# EAGLE schematic pos_sys (EAGLE 6.3)
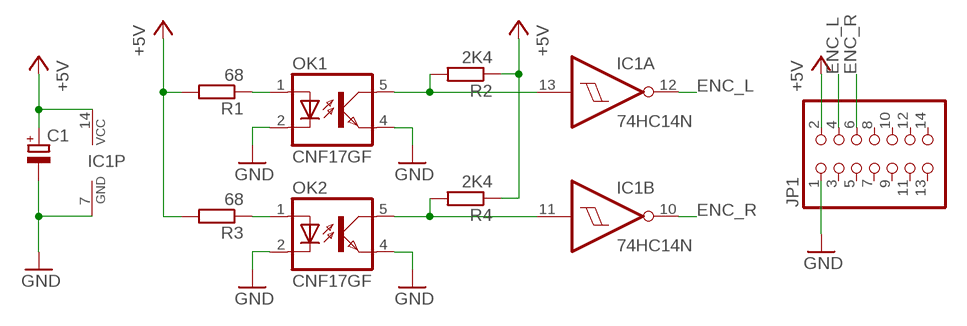
[diagram p0: schematic, sheet 1]

## Parts
C1  CPOL-EUB45181C  [B45181C]
IC1  74HC14N  [DIL14]
JP1  PINHD-2X7  [2X07]
OK1  CNF17GF  [DIL06B]
OK2  CNF17GF  [DIL06B]
R1  68  R-EU_0204/7  [0204/7]
R2  2K4  R-EU_0204/7  [0204/7]
R3  68  R-EU_0204/7  [0204/7]
R4  2K4  R-EU_0204/7  [0204/7]

## Nets
+5V: C1.+ IC1.14(P:VCC) JP1.2 R1.2 R2.1 R3.2 R4.1
ENC_L: IC1.12(A:O) JP1.4
ENC_R: IC1.10(B:O) JP1.6
GND: C1.- IC1.7(P:GND) JP1.1 OK1.2(C) OK1.4(EMIT) OK2.2(C) OK2.4(EMIT)
N$1: OK1.1(A) R1.1
N$2: OK2.1(A) R3.1
N$3: IC1.13(A:I) OK1.5(COL) R2.2
N$4: IC1.11(B:I) OK2.5(COL) R4.2
Unconnected: IC1.1(D:I) IC1.2(D:O) IC1.3(E:I) IC1.4(E:O) IC1.5(F:I) IC1.6(F:O) IC1.8(C:O) IC1.9(C:I) JP1.3 JP1.5 JP1.7 JP1.8 JP1.9 JP1.10 JP1.11 JP1.12 JP1.13 JP1.14

## Library data of the parts
C1 = rcl:CPOL-EU: POLARIZED CAPACITOR, European symbol
IC1 = 74xx-eu:74*14: Hex schmitt trigger INVERTER
JP1 = pinhead:PINHD-2X7: PIN HEADER
OK1 OK2 = optocoupler:CNF17GF: HEWLETT PACKARD OPTO COUPLER; OC_FARNELL: unknown; OC_NEWARK: unknown
R1-R4 = rcl:R-EU_: RESISTOR, European symbol